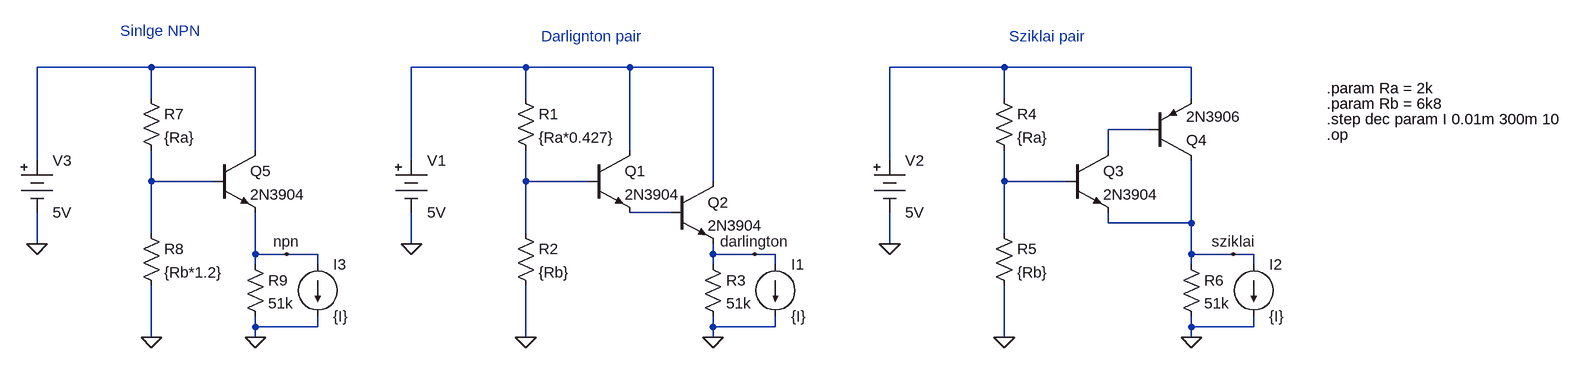
[diagram p0: schematic NPNreg.asc]
NPNreg.asc, the LTspice schematic file:
Version 4
SHEET 1 2052 680
WIRE -400 -16 -576 -16
WIRE -240 -16 -400 -16
WIRE 176 -16 0 -16
WIRE 336 -16 176 -16
WIRE 464 -16 336 -16
WIRE 912 -16 736 -16
WIRE 1200 -16 912 -16
WIRE -400 32 -400 -16
WIRE 176 32 176 -16
WIRE 912 32 912 -16
WIRE 1200 32 1200 -16
WIRE 1136 80 1072 80
WIRE -240 112 -240 -16
WIRE 336 112 336 -16
WIRE 1072 112 1072 80
WIRE -576 128 -576 -16
WIRE 0 128 0 -16
WIRE 736 128 736 -16
WIRE -400 160 -400 112
WIRE -304 160 -400 160
WIRE 176 160 176 112
WIRE 272 160 176 160
WIRE 464 160 464 -16
WIRE 912 160 912 112
WIRE 1008 160 912 160
WIRE 400 208 336 208
WIRE 1072 224 1072 208
WIRE 1200 224 1200 128
WIRE 1200 224 1072 224
WIRE -400 240 -400 160
WIRE 176 240 176 160
WIRE 912 240 912 160
WIRE -576 256 -576 208
WIRE 0 256 0 208
WIRE 736 256 736 208
WIRE -240 272 -240 208
WIRE -192 272 -240 272
WIRE -144 272 -192 272
WIRE 464 272 464 256
WIRE 528 272 464 272
WIRE 560 272 528 272
WIRE 1200 272 1200 224
WIRE 1264 272 1200 272
WIRE 1296 272 1264 272
WIRE -240 288 -240 272
WIRE -144 288 -144 272
WIRE 464 288 464 272
WIRE 560 288 560 272
WIRE 1200 288 1200 272
WIRE 1296 288 1296 272
WIRE -240 384 -240 368
WIRE -144 384 -144 368
WIRE -144 384 -240 384
WIRE 464 384 464 368
WIRE 560 384 560 368
WIRE 560 384 464 384
WIRE 1200 384 1200 368
WIRE 1296 384 1296 368
WIRE 1296 384 1200 384
WIRE -400 400 -400 320
WIRE -240 400 -240 384
WIRE 176 400 176 320
WIRE 464 400 464 384
WIRE 912 400 912 320
WIRE 1200 400 1200 384
FLAG 0 256 0
FLAG 176 400 0
FLAG 464 400 0
FLAG 736 256 0
FLAG 912 400 0
FLAG 1200 400 0
FLAG -576 256 0
FLAG -400 400 0
FLAG -240 400 0
FLAG -192 272 npn
FLAG 528 272 darlington
FLAG 1264 272 sziklai
SYMBOL Misc\\battery 0 112 R0
WINDOW 123 0 0 Left 2
WINDOW 39 24 128 Left 2
SYMATTR InstName V1
SYMATTR Value 5V
SYMBOL npn 272 112 R0
SYMATTR InstName Q1
SYMATTR Value 2N3904
SYMBOL res 160 16 R0
SYMATTR InstName R1
SYMATTR Value {Ra*0.427}
SYMBOL res 160 224 R0
SYMATTR InstName R2
SYMATTR Value {Rb}
SYMBOL npn 400 160 R0
SYMATTR InstName Q2
SYMATTR Value 2N3904
SYMBOL current 560 288 R0
WINDOW 123 0 0 Left 2
WINDOW 39 0 0 Left 2
SYMATTR InstName I1
SYMATTR Value {I}
SYMBOL res 448 272 R0
SYMATTR InstName R3
SYMATTR Value 51k
SYMBOL Misc\\battery 736 112 R0
WINDOW 123 0 0 Left 2
WINDOW 39 24 128 Left 2
SYMATTR InstName V2
SYMATTR Value 5V
SYMBOL npn 1008 112 R0
SYMATTR InstName Q3
SYMATTR Value 2N3904
SYMBOL res 896 16 R0
SYMATTR InstName R4
SYMATTR Value {Ra}
SYMBOL res 896 224 R0
SYMATTR InstName R5
SYMATTR Value {Rb}
SYMBOL current 1296 288 R0
WINDOW 123 0 0 Left 2
WINDOW 39 0 0 Left 2
SYMATTR InstName I2
SYMATTR Value {I}
SYMBOL pnp 1136 128 M180
SYMATTR InstName Q4
SYMATTR Value 2N3906
SYMBOL res 1184 272 R0
SYMATTR InstName R6
SYMATTR Value 51k
SYMBOL Misc\\battery -576 112 R0
WINDOW 123 0 0 Left 2
WINDOW 39 24 128 Left 2
SYMATTR InstName V3
SYMATTR Value 5V
SYMBOL npn -304 112 R0
SYMATTR InstName Q5
SYMATTR Value 2N3904
SYMBOL res -416 16 R0
SYMATTR InstName R7
SYMATTR Value {Ra}
SYMBOL res -416 224 R0
SYMATTR InstName R8
SYMATTR Value {Rb*1.2}
SYMBOL current -144 288 R0
WINDOW 123 0 0 Left 2
WINDOW 39 0 0 Left 2
SYMATTR InstName I3
SYMATTR Value {I}
SYMBOL res -256 272 R0
SYMATTR InstName R9
SYMATTR Value 51k
TEXT 1408 88 Left 2 !.op
TEXT 1408 64 Left 2 !.step dec param I 0.01m 300m 10
TEXT 1408 16 Left 2 !.param Ra = 2k
TEXT 1408 40 Left 2 !.param Rb = 6k8
TEXT -448 -72 Left 2 ;Sinlge NPN
TEXT 200 -64 Left 2 ;Darlignton pair
TEXT 920 -64 Left 2 ;Sziklai pair

The netlist it stands for:
* NPNreg.asc
V1 N002 0 5V
Q1 N002 N006 N008 0 2N3904
R1 N002 N006 {Ra*0.427}
R2 N006 0 {Rb}
Q2 N002 N008 darlington 0 2N3904
I1 darlington 0 {I}
R3 darlington 0 51k
V2 N003 0 5V
Q3 N004 N007 sziklai 0 2N3904
R4 N003 N007 {Ra}
R5 N007 0 {Rb}
I2 sziklai 0 {I}
Q4 sziklai N004 N003 0 2N3906
R6 sziklai 0 51k
V3 N001 0 5V
Q5 N001 N005 npn 0 2N3904
R7 N001 N005 {Ra}
R8 N005 0 {Rb*1.2}
I3 npn 0 {I}
R9 npn 0 51k
.model NPN NPN
.model PNP PNP
.lib standard.bjt
.op
.step dec param I 0.01m 300m 10
.param Ra = 2k
.param Rb = 6k8
* Sinlge NPN
* Darlignton pair
* Sziklai pair
.backanno
.end